# Altium project Encoder.PrjPcb
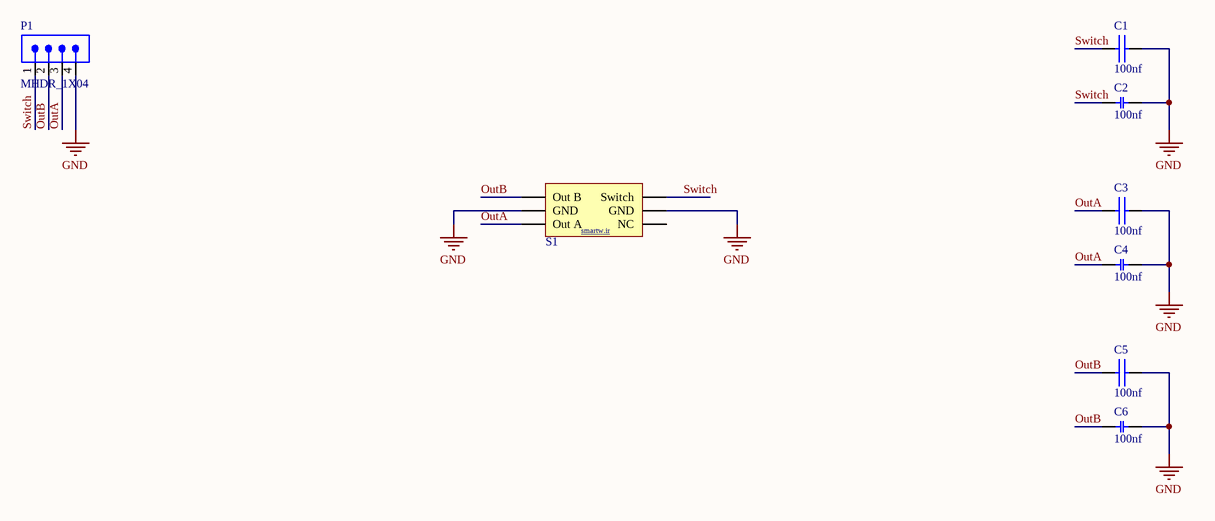
[diagram p0: Encoder.SchDoc]
1 sheet, 8 parts. Net scope: global (net labels, ports and power ports of the same name join across sheets).
Board file: Encoder.PcbDoc

## Sheet Encoder.SchDoc
size A4

### Parts
C1  value 100nf  [C_CER_M5]  (hidden comment: Capacitor Ceramic THD)
C2  value 100nf  [C1206]  (hidden comment: Capacitor C SMD 1206)
C3  value 100nf  [C_CER_M5]  (hidden comment: Capacitor Ceramic THD)
C4  value 100nf  [C1206]  (hidden comment: Capacitor C SMD 1206)
C5  value 100nf  [C_CER_M5]  (hidden comment: Capacitor Ceramic THD)
C6  value 100nf  [C1206]  (hidden comment: Capacitor C SMD 1206)
P1  MHDR_1X04  [MHDR1X04-254P]
S1  Encoder  [Encoder]  (value not drawn)

### Nets
GND: C1.2(-) C2.2 C3.2(-) C4.2 C5.2(-) C6.2 P1.4 S1.3(GND) S1.4(GND)
OutA: C3.1(+) C4.1 P1.3 S1.1(Out_A)
OutB: C5.1(+) C6.1 P1.2 S1.2(Out_B)
Switch: C1.1(+) C2.1 P1.1 S1.5(Switch)

Not connected (* = marked no-connect by the designer): S1 0(NC)

### Notes on the sheet
- (in symbol Encoder) smartw.ir

### Library data of the parts
P1 = MHDR_1X04: Male Header 1X04
C1 C3 C5 = Capacitor Ceramic THD: DatasheetVersion: 2021; ComponentLink1Description: Website Smart World; ComponentLink1URL: https://www.smartw.ir/; ComponentLink2Description: Telegram; ComponentLink2URL: https://t.me/altium_smartw; ComponentLink3Description: Instagram; ComponentLink3URL: https://Instagram.com/smartgw.ir
C2 C4 C6 = Capacitor C SMD 1206: DatasheetVersion: 2021; ComponentLink1Description: Website Smart World; ComponentLink1URL: https://www.smartw.ir/; ComponentLink2Description: Telegram; ComponentLink2URL: https://t.me/altium_smartw; ComponentLink3Description: Instagram; ComponentLink3URL: https://Instagram.com/smartgw.ir
S1 = Encoder: ComponentLink1Description: Website Smart World; ComponentLink1URL: https://www.smartw.ir/; ComponentLink2Description: Telegram; ComponentLink2URL: https://t.me/altium_smartw; ComponentLink3Description: Instagram; ComponentLink3URL: https://Instagram.com/smartgw.ir; DatasheetVersion: 2021